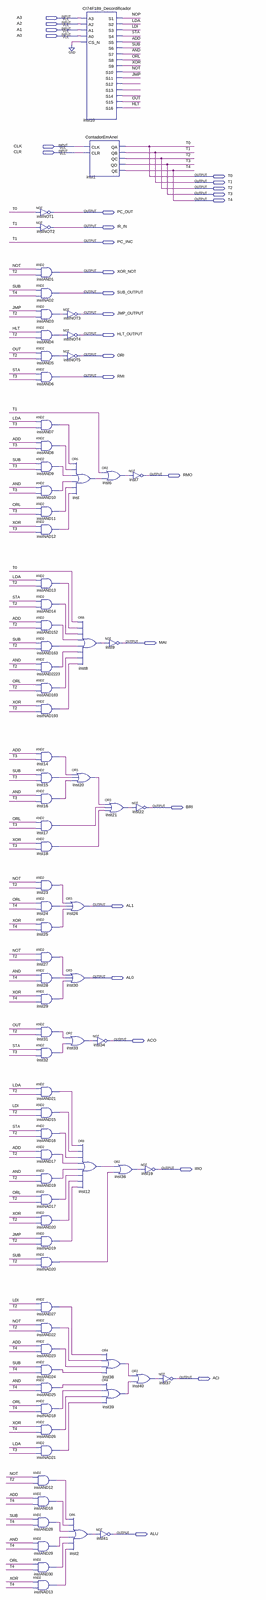
[diagram p0: schematic sheet, whole]
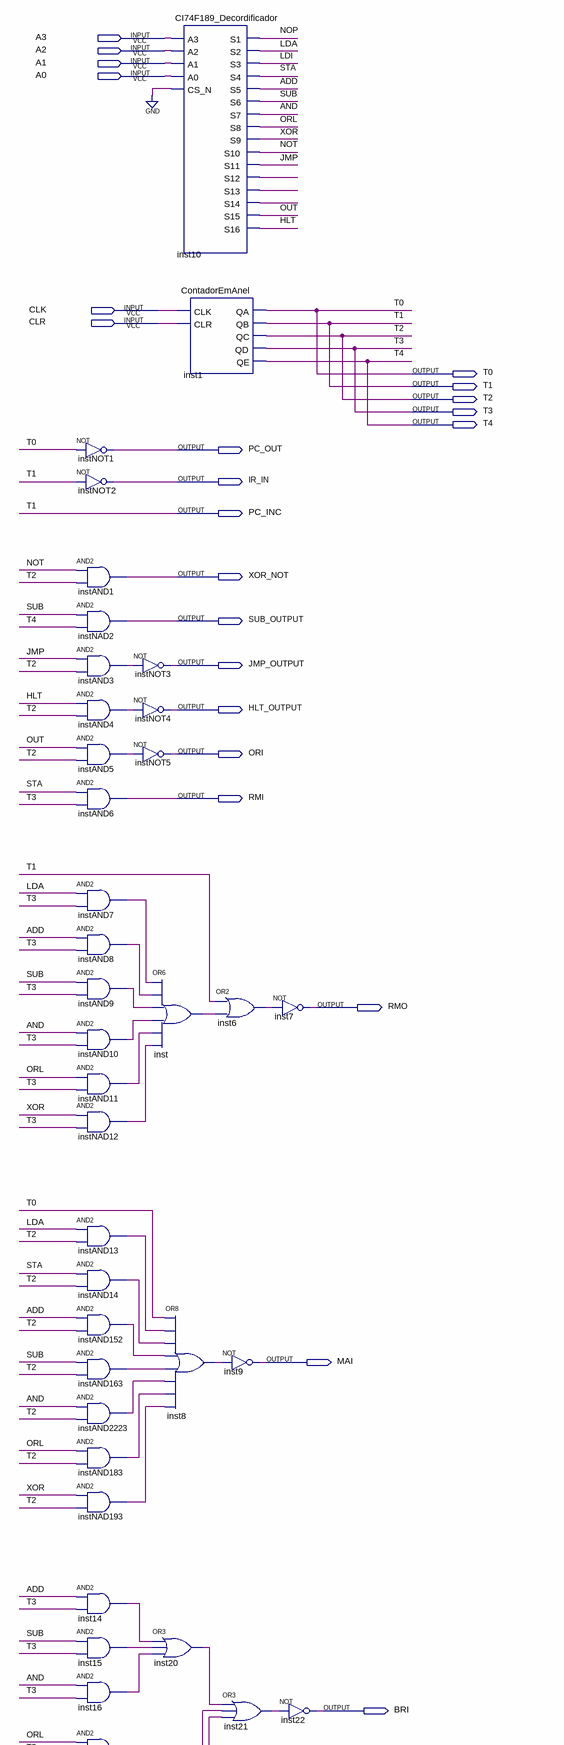
[diagram p1: schematic sheet, upper part]
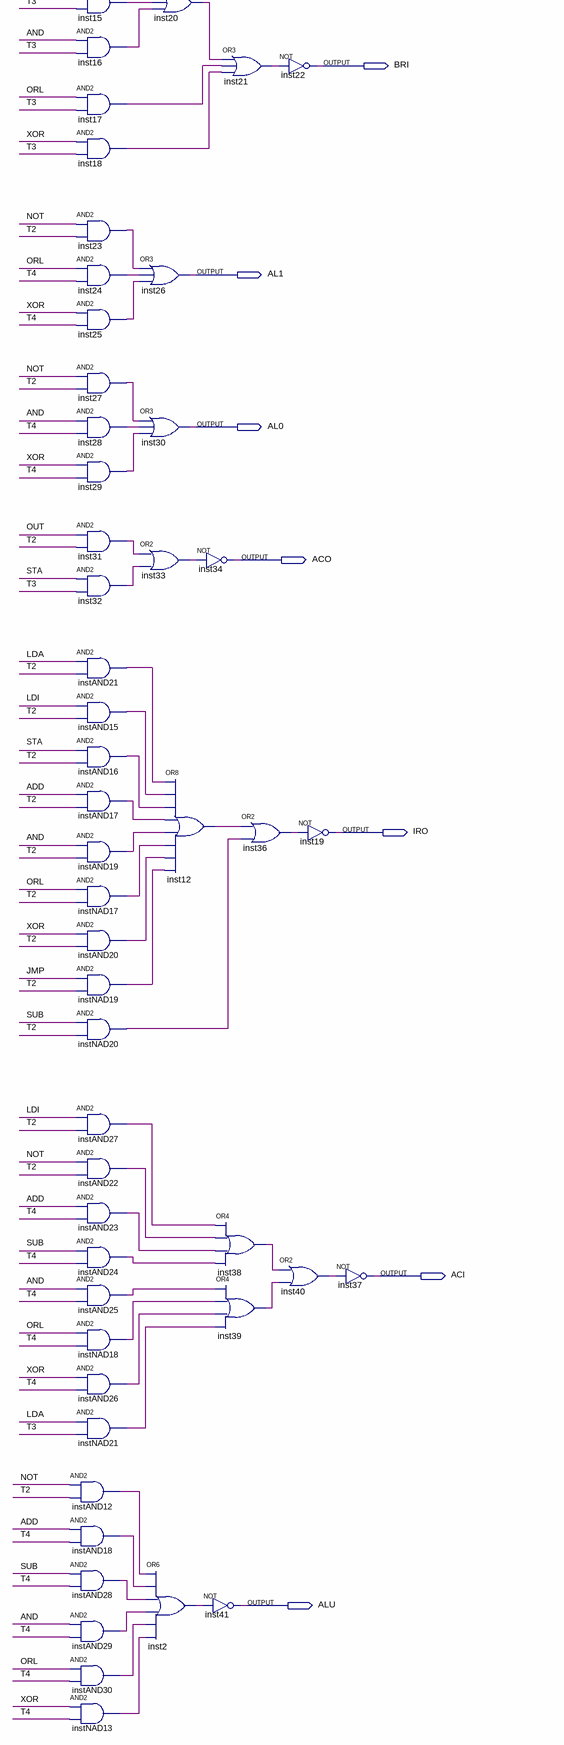
[diagram p2: schematic sheet, lower part]
// Quartus schematic Controller.bdf as structural Verilog: 83 symbols, 29 pins
module Controller (
  input  A3,
  input  A2,
  input  A1,
  input  A0,
  input  CLK,
  input  CLR,
  output T0,
  output T1,
  output T2,
  output T3,
  output T4,
  output PC_OUT,
  output IR_IN,
  output PC_INC,
  output XOR_NOT,
  output SUB_OUTPUT,
  output JMP_OUTPUT,
  output HLT_OUTPUT,
  output ORI,
  output RMI,
  output RMO,
  output MAI,
  output BRI,
  output AL1,
  output AL0,
  output ACO,
  output IRO,
  output ACI,
  output ALU
);

  wire ADD, AND, HLT, inst2_out, inst6_out, inst8_out, inst10_s12, inst10_s13, inst10_s14, inst12_out,
       inst14_out, inst15_out, inst16_out, inst17_out, inst18_out, inst20_out, inst21_out, inst23_out,
       inst24_out, inst25_out, inst27_out, inst28_out, inst29_out, inst31_out, inst32_out, inst33_out,
       inst36_out, inst38_out, inst39_out, inst40_out, inst_out, instAND3_out, instAND4_out, instAND5_out,
       instAND7_out, instAND8_out, instAND9_out, instAND10_out, instAND11_out, instAND12_out, instAND13_out,
       instAND14_out, instAND15_out, instAND16_out, instAND17_out, instAND18_out, instAND19_out,
       instAND20_out, instAND21_out, instAND22_out, instAND23_out, instAND24_out, instAND25_out,
       instAND26_out, instAND27_out, instAND28_out, instAND29_out, instAND30_out, instAND152_out,
       instAND163_out, instAND183_out, instAND2223_out, instNAD12_out, instNAD13_out, instNAD17_out,
       instNAD18_out, instNAD19_out, instNAD20_out, instNAD21_out, instNAD193_out, JMP, LDA, LDI, NOP, NOT,
       ORL, OUT, STA, SUB, XOR;

  not instNOT1 (PC_OUT, T0);
  not instNOT2 (IR_IN, PC_INC);
  and instAND1 (XOR_NOT, NOT, T2);
  and instNAD2 (SUB_OUTPUT, SUB, T4);
  and instAND3 (instAND3_out, JMP, T2);
  and instAND4 (instAND4_out, HLT, T2);
  and instAND5 (instAND5_out, OUT, T2);
  and instAND6 (RMI, STA, T3);
  and instAND7 (instAND7_out, LDA, T3);
  and instAND8 (instAND8_out, ADD, T3);
  and instAND9 (instAND9_out, SUB, T3);
  and instAND10 (instAND10_out, AND, T3);
  and instAND11 (instAND11_out, ORL, T3);
  and instNAD12 (instNAD12_out, XOR, T3);
  and instAND13 (instAND13_out, LDA, T2);
  and instAND14 (instAND14_out, STA, T2);
  and instAND152 (instAND152_out, ADD, T2);
  and instAND163 (instAND163_out, SUB, T2);
  and instAND2223 (instAND2223_out, AND, T2);
  and instAND183 (instAND183_out, ORL, T2);
  and instNAD193 (instNAD193_out, XOR, T2);
  and inst14 (inst14_out, ADD, T3);
  and inst15 (inst15_out, SUB, T3);
  and inst16 (inst16_out, AND, T3);
  and inst17 (inst17_out, ORL, T3);
  and inst18 (inst18_out, XOR, T3);
  and inst23 (inst23_out, NOT, T2);
  and inst24 (inst24_out, ORL, T4);
  and inst25 (inst25_out, XOR, T4);
  and inst27 (inst27_out, NOT, T2);
  and inst28 (inst28_out, AND, T4);
  and inst29 (inst29_out, XOR, T4);
  and inst31 (inst31_out, OUT, T2);
  and inst32 (inst32_out, STA, T3);
  and instAND21 (instAND21_out, LDA, T2);
  and instAND15 (instAND15_out, LDI, T2);
  and instAND16 (instAND16_out, STA, T2);
  and instAND17 (instAND17_out, ADD, T2);
  and instAND19 (instAND19_out, AND, T2);
  and instNAD17 (instNAD17_out, ORL, T2);
  and instAND20 (instAND20_out, XOR, T2);
  and instNAD19 (instNAD19_out, JMP, T2);
  and instNAD20 (instNAD20_out, SUB, T2);
  and instAND27 (instAND27_out, LDI, T2);
  and instAND22 (instAND22_out, NOT, T2);
  and instAND23 (instAND23_out, ADD, T4);
  and instAND24 (instAND24_out, SUB, T4);
  and instAND25 (instAND25_out, AND, T4);
  and instNAD18 (instNAD18_out, ORL, T4);
  and instAND26 (instAND26_out, XOR, T4);
  and instNAD21 (instNAD21_out, LDA, T3);
  and instAND12 (instAND12_out, NOT, T2);
  and instAND18 (instAND18_out, ADD, T4);
  and instAND28 (instAND28_out, SUB, T4);
  and instAND29 (instAND29_out, AND, T4);
  and instAND30 (instAND30_out, ORL, T4);
  and instNAD13 (instNAD13_out, XOR, T4);
  not instNOT3 (JMP_OUTPUT, instAND3_out);
  not instNOT4 (HLT_OUTPUT, instAND4_out);
  not instNOT5 (ORI, instAND5_out);
  or inst26 (AL1, inst23_out, inst24_out, inst25_out);
  or inst30 (AL0, inst27_out, inst28_out, inst29_out);
  or inst33 (inst33_out, inst31_out, inst32_out);
  CI74F189_Decordificador inst10 (
    .A3(A3), .A2(A2), .A1(A1), .A0(A0), .CS_N(1'b0), .S1(NOP), .S2(LDA), .S3(LDI), .S4(STA), .S5(ADD),
    .S6(SUB), .S7(AND), .S8(ORL), .S9(XOR), .S10(NOT), .S11(JMP), .S12(inst10_s12), .S13(inst10_s13),
    .S14(inst10_s14), .S15(OUT), .S16(HLT));
  ContadorEmAnel inst1 (.CLK(CLK), .CLR(CLR), .QA(T0), .QD(T3), .QB(PC_INC), .QC(T2), .QE(T4));
  or inst (inst_out, instAND7_out, instAND8_out, instAND9_out, instAND10_out, instAND11_out, instNAD12_out);
  or inst8 (inst8_out, T0, instAND13_out, instAND14_out, instAND152_out, instAND163_out, instAND2223_out, instAND183_out, instNAD193_out);
  or inst20 (inst20_out, inst14_out, inst15_out, inst16_out);
  or inst12 (inst12_out, instAND21_out, instAND15_out, instAND16_out, instAND17_out, instAND19_out, instNAD17_out, instAND20_out, instNAD19_out);
  or inst2 (inst2_out, instAND12_out, instAND18_out, instAND28_out, instAND29_out, instAND30_out, instNAD13_out);
  or inst6 (inst6_out, PC_INC, inst_out);
  not inst9 (MAI, inst8_out);
  or inst21 (inst21_out, inst20_out, inst17_out, inst18_out);
  not inst34 (ACO, inst33_out);
  or inst36 (inst36_out, inst12_out, instNAD20_out);
  or inst38 (inst38_out, instAND27_out, instAND22_out, instAND23_out, instAND24_out);
  or inst39 (inst39_out, instAND25_out, instNAD18_out, instAND26_out, instNAD21_out);
  not inst41 (ALU, inst2_out);
  not inst7 (RMO, inst6_out);
  not inst22 (BRI, inst21_out);
  or inst40 (inst40_out, inst38_out, inst39_out);
  not inst19 (IRO, inst36_out);
  not inst37 (ACI, inst40_out);

  assign T1 = PC_INC;
endmodule
